# Altium schematic sheet CurrentToVoltage_Converter.SchDoc: FloripaSat / OBDHTTC Subsystem /  Current to Voltage Convertion
size A4; SheetNumber: 4; SheetTotal: 11
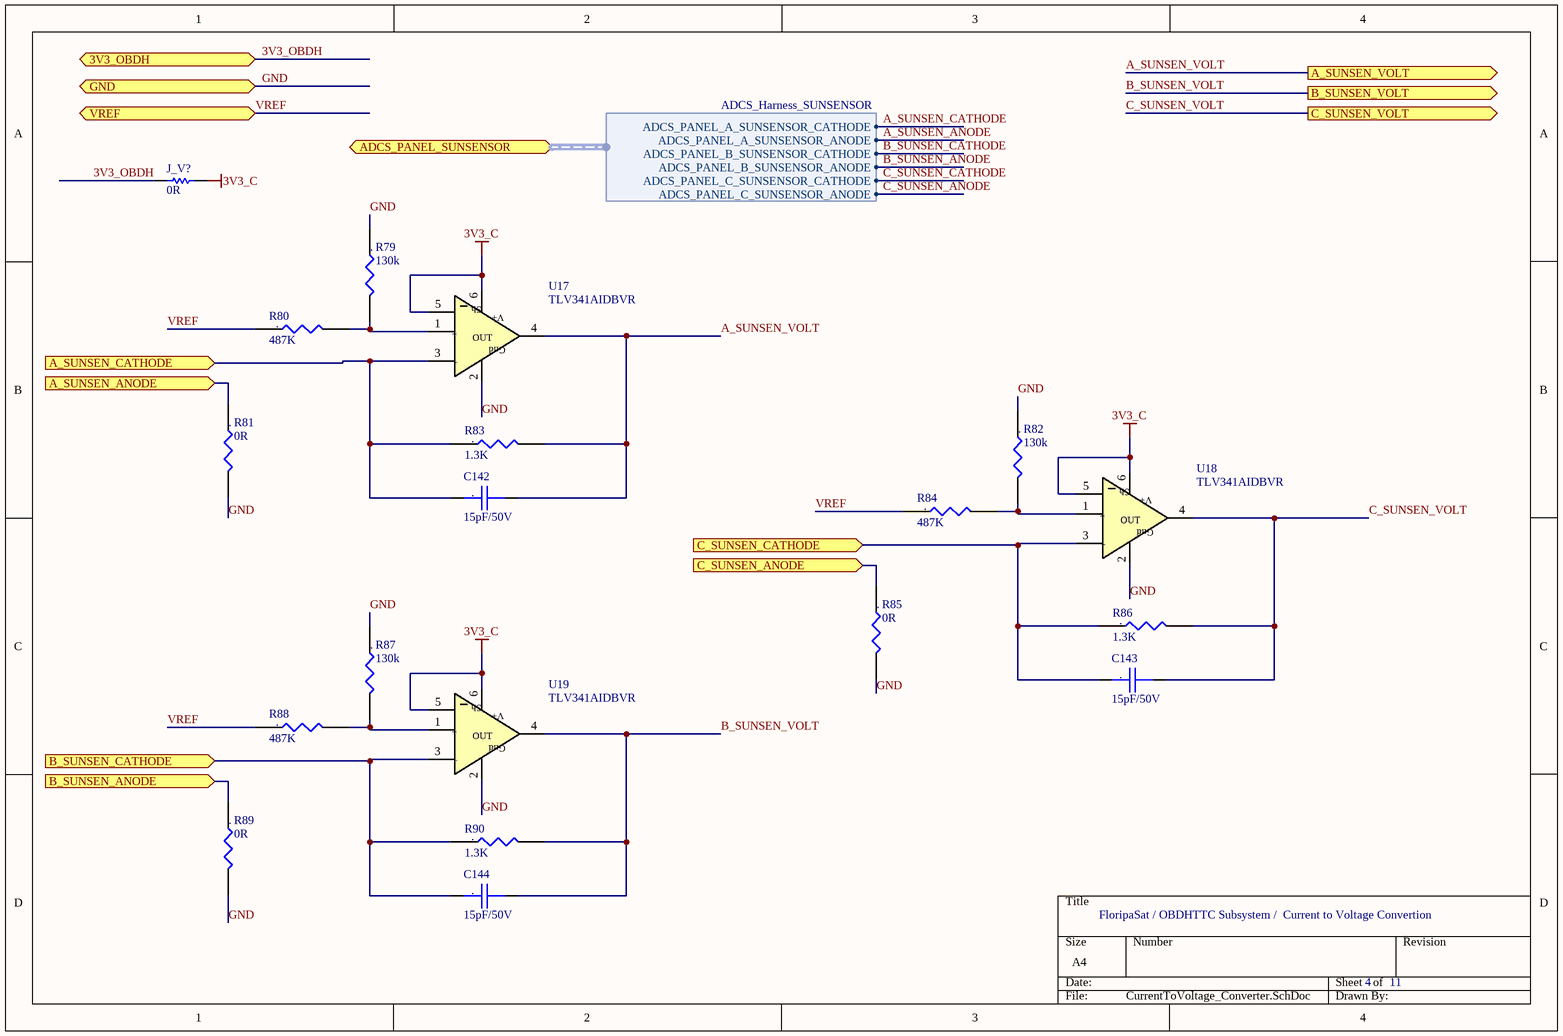
[diagram p0: CurrentToVoltage_Converter.SchDoc]

## Parts
C142  15pF/50V  [CC0603]
C143  15pF/50V  [CC0603]
C144  15pF/50V  [CC0603]
J_V?  0R  [0805]
R79  130k  [0603]
R80  487K  [0603]
R81  0R  [0603]
R82  130k  [0603]
R83  1.3K  [0603]
R84  487K  [0603]
R85  0R  [0603]
R86  1.3K  [0603]
R87  130k  [0603]
R88  487K  [0603]
R89  0R  [0603]
R90  1.3K  [0603]
U17  TLV341AIDBVR  [SOT-23 6L]
U18  TLV341AIDBVR  [SOT-23 6L]
U19  TLV341AIDBVR  [SOT-23 6L]

## Ports
3V3_OBDH, A_SUNSEN_ANODE (in), A_SUNSEN_CATHODE (in), A_SUNSEN_VOLT (out), ADCS_PANEL_SUNSENSOR (harness ADCS_Harness_SUNSENSOR), B_SUNSEN_ANODE (in), B_SUNSEN_CATHODE (in), B_SUNSEN_VOLT (out), C_SUNSEN_ANODE (in), C_SUNSEN_CATHODE (in), C_SUNSEN_VOLT (out), GND, VREF

## Harnesses
ADCS_Harness_SUNSENSOR: ADCS_PANEL_A_SUNSENSOR_ANODE, ADCS_PANEL_A_SUNSENSOR_CATHODE, ADCS_PANEL_B_SUNSENSOR_ANODE, ADCS_PANEL_B_SUNSENSOR_CATHODE, ADCS_PANEL_C_SUNSENSOR_ANODE, ADCS_PANEL_C_SUNSENSOR_CATHODE

## Nets
3V3_C: J_V?.1 U17.5(EN) U17.6(V+) U18.5(EN) U18.6(V+) U19.5(EN) U19.6(V+)
3V3_OBDH: J_V?.2 ; port 3V3_OBDH
A_SUNSEN_ANODE: R81.1 ; port A_SUNSEN_ANODE
A_SUNSEN_ANODE: port ADCS_PANEL_SUNSENSOR.ADCS_PANEL_A_SUNSENSOR_ANODE  [a separate net that carries the same name]
A_SUNSEN_CATHODE: C142.1 R83.1 U17.3(-IN) ; port A_SUNSEN_CATHODE
A_SUNSEN_CATHODE: port ADCS_PANEL_SUNSENSOR.ADCS_PANEL_A_SUNSENSOR_CATHODE  [a separate net that carries the same name]
A_SUNSEN_VOLT: C142.2 R83.2 U17.4(OUT) ; port A_SUNSEN_VOLT
B_SUNSEN_ANODE: R89.1 ; port B_SUNSEN_ANODE
B_SUNSEN_ANODE: port ADCS_PANEL_SUNSENSOR.ADCS_PANEL_B_SUNSENSOR_ANODE  [a separate net that carries the same name]
B_SUNSEN_CATHODE: C144.1 R90.1 U19.3(-IN) ; port B_SUNSEN_CATHODE
B_SUNSEN_CATHODE: port ADCS_PANEL_SUNSENSOR.ADCS_PANEL_B_SUNSENSOR_CATHODE  [a separate net that carries the same name]
B_SUNSEN_VOLT: C144.2 R90.2 U19.4(OUT) ; port B_SUNSEN_VOLT
C_SUNSEN_ANODE: R85.1 ; port C_SUNSEN_ANODE
C_SUNSEN_ANODE: port ADCS_PANEL_SUNSENSOR.ADCS_PANEL_C_SUNSENSOR_ANODE  [a separate net that carries the same name]
C_SUNSEN_CATHODE: C143.1 R86.1 U18.3(-IN) ; port C_SUNSEN_CATHODE
C_SUNSEN_CATHODE: port ADCS_PANEL_SUNSENSOR.ADCS_PANEL_C_SUNSENSOR_CATHODE  [a separate net that carries the same name]
C_SUNSEN_VOLT: C143.2 R86.2 U18.4(OUT) ; port C_SUNSEN_VOLT
GND: R79.1 R81.2 R82.1 R85.2 R87.1 R89.2 U17.2(Gnd) U18.2(Gnd) U19.2(Gnd) ; port GND
VREF: R80.1 R84.1 R88.1 ; port VREF
NetR79_2: R79.2 R80.2 U17.1(+IN)
NetR82_2: R82.2 R84.2 U18.1(+IN)
NetR87_2: R87.2 R88.2 U19.1(+IN)

## Notes on the sheet
- (in symbol Cap_Cer_X7R_15pF_50V_0603) .
- (in symbol R0R_JUMPER_1/10W_0603) .
- (in symbol R1.3K_1%_1/10W_0603) .
- (in symbol R130k_0.1%_1/10W_0603) .
- (in symbol R487k_1%_1/10W_0603) .
- (in symbol TLV341AIDBVR) Sh; +; -

## Library data of the parts
C142-C144 = Cap_Cer_X7R_15pF_50V_0603: CAP CER 15pF 50V 0603; Partnumber: GQM1885C1H150JB01D; NCM: 8532.24.10
J_V? = R0R_JUMPER_1/16W_0805: RES 0R OHM 1/16W JUMPER 0805; Partnumber: CRCW08050000Z0EA; NCM: 8533.21.20
R79 R82 R87 = R130k_0.1%_1/10W_0603: RES 130K OHM 1/10W 0.1% 0603; Partnumber: CRCW0603130KFKEA; NCM: 8533.21.20
R80 R84 R88 = R487k_1%_1/10W_0603: RES 487k OHM 1/10W 1% 0603; Partnumber: RC0603FR-07487KL; NCM: 8533.21.20
R81 R85 R89 = R0R_JUMPER_1/10W_0603: RES 0.0 OHM 1/10W JUMP 0603; Partnumber: RC1608J000CS; NCM: 8533.21.20
R83 R86 R90 = R1.3K_1%_1/10W_0603: RES 1.3K OHM 1/10W 1% 0603; Partnumber: CRCW06031K30FKEA; NCM: 8533.21.20
U17-U19 = TLV341AIDBVR: Partnumber: TLV341AIDBVR